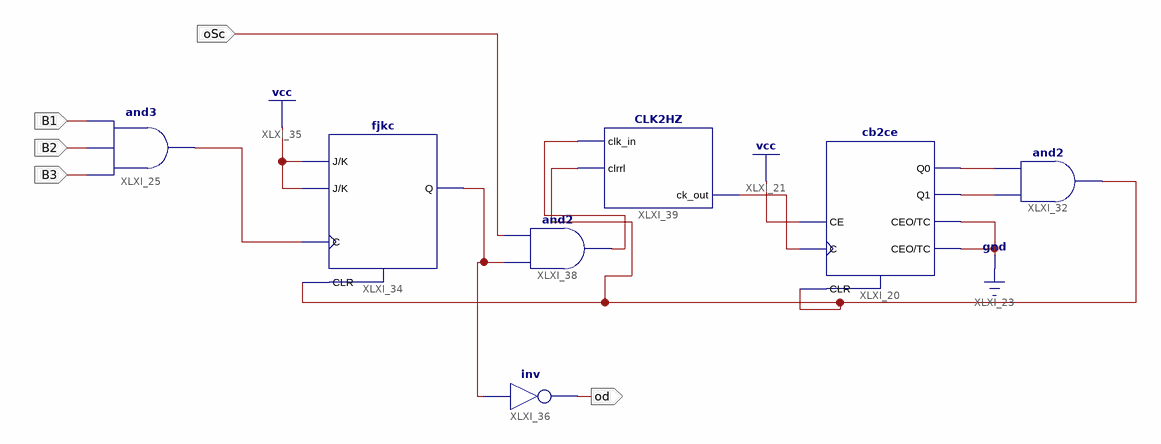
[diagram p0: schematic sheet 1]
// Xilinx ISE schematic oneTime.sch (spartan6) as structural Verilog: 7 symbols, 5 ports
module oneTime (
  input  oSc,
  input  B3,
  input  B2,
  input  B1,
  output od
);

  wire ind, opo, XLXN_78, XLXN_94, XLXN_96, XLXN_101, XLXN_110;

  cb2ce XLXI_20 (.C(XLXN_78), .CE(1'b1), .CLR(opo), .CEO(1'b0), .Q0(XLXN_101), .Q1(XLXN_96), .TC(1'b0));
  and XLXI_25 (ind, B3, B2, B1);
  and XLXI_32 (opo, XLXN_96, XLXN_101);
  fjkc XLXI_34 (.C(ind), .CLR(opo), .J(1'b1), .K(1'b1), .Q(XLXN_94));
  not XLXI_36 (od, XLXN_94);
  and XLXI_38 (XLXN_110, XLXN_94, oSc);
  CLK2HZ XLXI_39 (.clk_in(XLXN_110), .clrrl(opo), .ck_out(XLXN_78));
endmodule
